# Altium schematic sheet LED Heatsink.schdoc
size 108 x 91 mm
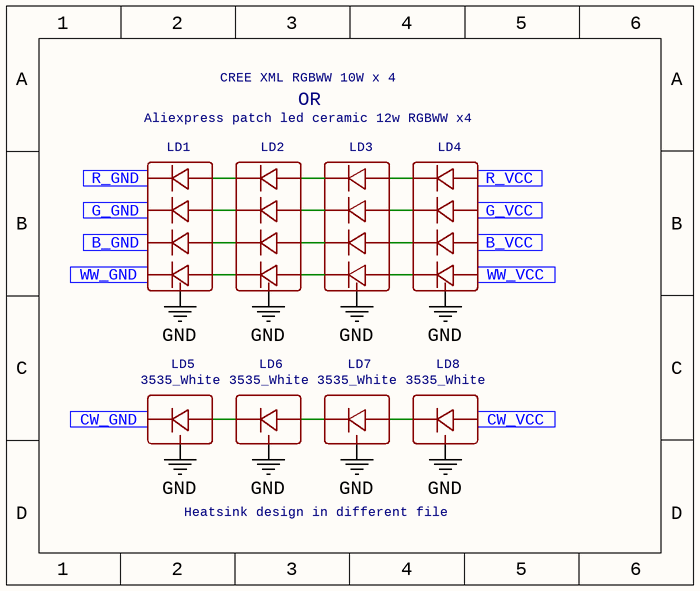
[diagram p0: LED Heatsink.schdoc]

## Parts
LD1  CREE XM-L Color Gen 2 High Intensity  [XMLDCL]  (value not drawn)
LD2  CREE XM-L Color Gen 2 High Intensity  [XMLDCL]  (value not drawn)
LD3  CREE XM-L Color Gen 2 High Intensity  [XMLDCL]  (value not drawn)
LD4  CREE XM-L Color Gen 2 High Intensity  [XMLDCL]  (value not drawn)
LD5  3535_White  [CREE 3535 ALIEXPRESS]
LD6  3535_White  [CREE 3535 ALIEXPRESS]
LD7  3535_White  [CREE 3535 ALIEXPRESS]
LD8  3535_White  [CREE 3535 ALIEXPRESS]

## Ports
B_GND (in), B_VCC (in), CW_GND (in), CW_VCC (in), G_GND (in), G_VCC (in), R_GND (in), R_VCC (in), WW_GND (in), WW_VCC (in)

## Nets
GND: LD1.9(HS) LD2.9(HS) LD3.9(HS) LD4.9(HS) LD5.3 LD6.3 LD7.3 LD8.3
B_GND: LD1.6 ; port B_GND
B_VCC: LD4.3 ; port B_VCC
CW_GND: LD5.1 ; port CW_GND
CW_VCC: LD8.2 ; port CW_VCC
G_GND: LD1.7 ; port G_GND
G_VCC: LD4.2 ; port G_VCC
R_GND: LD1.8 ; port R_GND
R_VCC: LD4.1 ; port R_VCC
WW_GND: LD1.5 ; port WW_GND
WW_VCC: LD4.4 ; port WW_VCC
NetLD1_1: LD1.1 LD2.8
NetLD1_2: LD1.2 LD2.7
NetLD1_3: LD1.3 LD2.6
NetLD1_4: LD1.4 LD2.5
NetLD2_1: LD2.1 LD3.8
NetLD2_2: LD2.2 LD3.7
NetLD2_3: LD2.3 LD3.6
NetLD2_4: LD2.4 LD3.5
NetLD3_1: LD3.1 LD4.8
NetLD3_2: LD3.2 LD4.7
NetLD3_3: LD3.3 LD4.6
NetLD3_4: LD3.4 LD4.5
NetLD5_2: LD5.2 LD6.1
NetLD6_2: LD6.2 LD7.1
NetLD7_2: LD7.2 LD8.1

## Notes on the sheet
- CREE XML RGBWW 10W x 4
- Aliexpress patch led ceramic 12w RGBWW x4
- OR
- Heatsink design in different file

## Library data of the parts
LD1-LD4 = CREE XM-L Color Gen 2 High Intensity: Contributor: Gerwin; Manufacturer: CREE; link: https://cree-led.com/media/documents/XLamp-XMLDCL.pdf; spicePre: L; spiceSymbolName: CREE XM-L Color Gen 2 High Intensity
LD5-LD8 = 3535_White: Contributor: hexawiz; spicePre: U; spiceSymbolName: CREE 3535 Aliexpress